# EAGLE schematic Main Board (EAGLE 5.10)
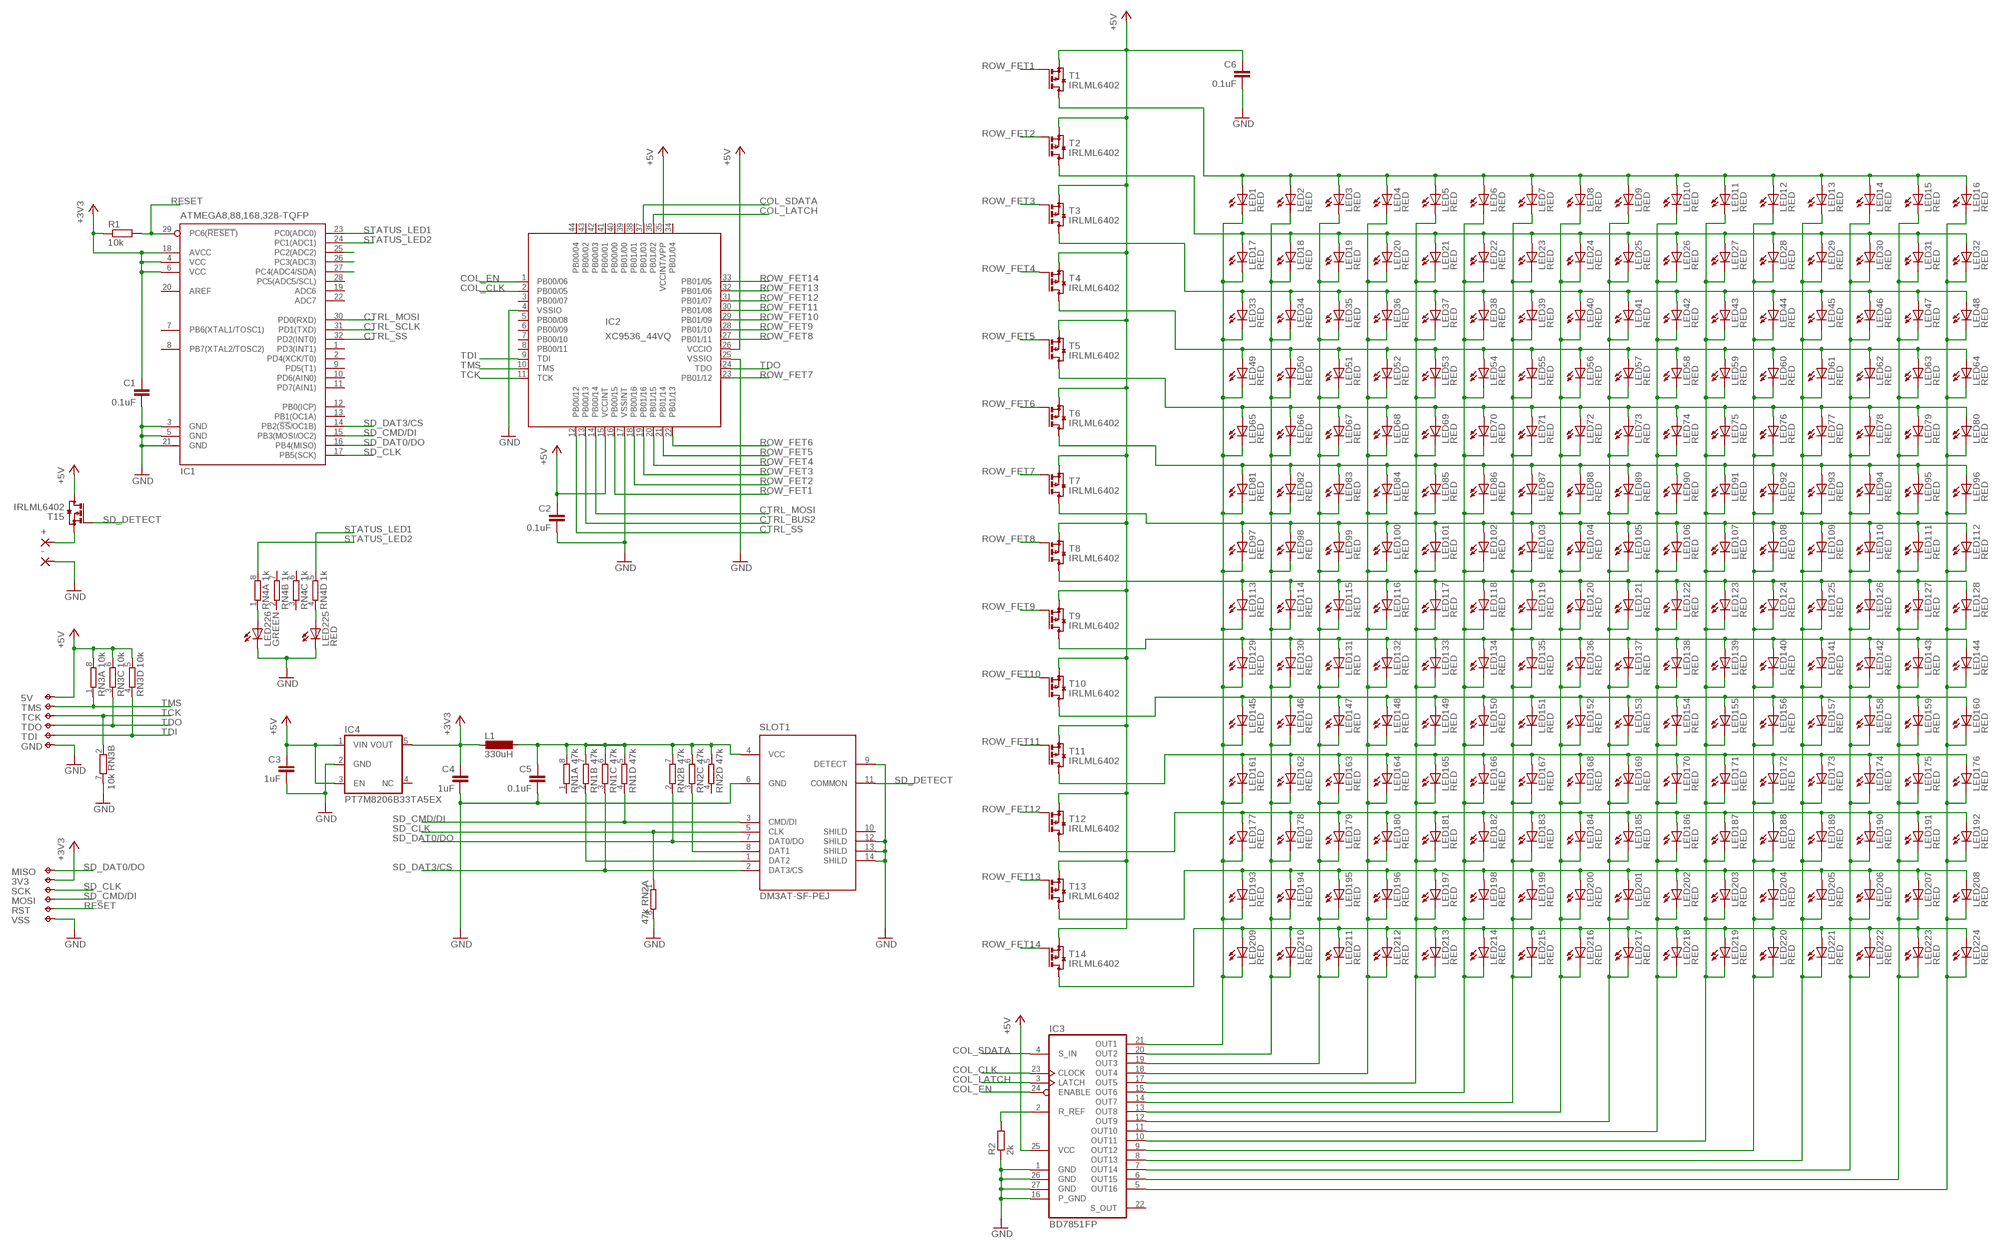
[diagram p0: schematic, sheet 1]

## Parts
3V3  TPTP10SQ  [TP10SQ]
5V  TPTP10SQ  [TP10SQ]
+  SMD2  [SMD1,27-2,54]
-  SMD2  [SMD1,27-2,54]
C1  0.1uF  C-EUC0603  [C0603]
C2  0.1uF  C-EUC0603  [C0603]
C3  1uF  C-EUC0603  [C0603]
C4  1uF  C-EUC0603  [C0603]
C5  0.1uF  C-EUC0603  [C0603]
C6  0.1uF  C-EUC0603  [C0603]
GND  TPTP10SQ  [TP10SQ]
IC1  ATMEGA8,88,168,328-TQFP  [TQFP32-08]
IC2  XC9536_44VQ  [SQFP-S-10X10-44]
IC3  BD7851FP  [HSOP25]
IC4  PT7M8206B33TA5EX  [SOT23-5L]
L1  330uH  L-EUL2012C  [L2012C]
LED1  RED  LEDCHIP-LED0603  [CHIP-LED0603]
LED2  RED  LEDCHIP-LED0603  [CHIP-LED0603]
LED3  RED  LEDCHIP-LED0603  [CHIP-LED0603]
LED4  RED  LEDCHIP-LED0603  [CHIP-LED0603]
LED5  RED  LEDCHIP-LED0603  [CHIP-LED0603]
LED6  RED  LEDCHIP-LED0603  [CHIP-LED0603]
LED7  RED  LEDCHIP-LED0603  [CHIP-LED0603]
LED8  RED  LEDCHIP-LED0603  [CHIP-LED0603]
LED9  RED  LEDCHIP-LED0603  [CHIP-LED0603]
LED10  RED  LEDCHIP-LED0603  [CHIP-LED0603]
LED11  RED  LEDCHIP-LED0603  [CHIP-LED0603]
LED12  RED  LEDCHIP-LED0603  [CHIP-LED0603]
LED13  RED  LEDCHIP-LED0603  [CHIP-LED0603]
LED14  RED  LEDCHIP-LED0603  [CHIP-LED0603]
LED15  RED  LEDCHIP-LED0603  [CHIP-LED0603]
LED16  RED  LEDCHIP-LED0603  [CHIP-LED0603]
LED17  RED  LEDCHIP-LED0603  [CHIP-LED0603]
LED18  RED  LEDCHIP-LED0603  [CHIP-LED0603]
LED19  RED  LEDCHIP-LED0603  [CHIP-LED0603]
LED20  RED  LEDCHIP-LED0603  [CHIP-LED0603]
LED21  RED  LEDCHIP-LED0603  [CHIP-LED0603]
LED22  RED  LEDCHIP-LED0603  [CHIP-LED0603]
LED23  RED  LEDCHIP-LED0603  [CHIP-LED0603]
LED24  RED  LEDCHIP-LED0603  [CHIP-LED0603]
LED25  RED  LEDCHIP-LED0603  [CHIP-LED0603]
LED26  RED  LEDCHIP-LED0603  [CHIP-LED0603]
LED27  RED  LEDCHIP-LED0603  [CHIP-LED0603]
LED28  RED  LEDCHIP-LED0603  [CHIP-LED0603]
LED29  RED  LEDCHIP-LED0603  [CHIP-LED0603]
LED30  RED  LEDCHIP-LED0603  [CHIP-LED0603]
LED31  RED  LEDCHIP-LED0603  [CHIP-LED0603]
LED32  RED  LEDCHIP-LED0603  [CHIP-LED0603]
LED33  RED  LEDCHIP-LED0603  [CHIP-LED0603]
LED34  RED  LEDCHIP-LED0603  [CHIP-LED0603]
LED35  RED  LEDCHIP-LED0603  [CHIP-LED0603]
LED36  RED  LEDCHIP-LED0603  [CHIP-LED0603]
LED37  RED  LEDCHIP-LED0603  [CHIP-LED0603]
LED38  RED  LEDCHIP-LED0603  [CHIP-LED0603]
LED39  RED  LEDCHIP-LED0603  [CHIP-LED0603]
LED40  RED  LEDCHIP-LED0603  [CHIP-LED0603]
LED41  RED  LEDCHIP-LED0603  [CHIP-LED0603]
LED42  RED  LEDCHIP-LED0603  [CHIP-LED0603]
LED43  RED  LEDCHIP-LED0603  [CHIP-LED0603]
LED44  RED  LEDCHIP-LED0603  [CHIP-LED0603]
LED45  RED  LEDCHIP-LED0603  [CHIP-LED0603]
LED46  RED  LEDCHIP-LED0603  [CHIP-LED0603]
LED47  RED  LEDCHIP-LED0603  [CHIP-LED0603]
LED48  RED  LEDCHIP-LED0603  [CHIP-LED0603]
LED49  RED  LEDCHIP-LED0603  [CHIP-LED0603]
LED50  RED  LEDCHIP-LED0603  [CHIP-LED0603]
LED51  RED  LEDCHIP-LED0603  [CHIP-LED0603]
LED52  RED  LEDCHIP-LED0603  [CHIP-LED0603]
LED53  RED  LEDCHIP-LED0603  [CHIP-LED0603]
LED54  RED  LEDCHIP-LED0603  [CHIP-LED0603]
LED55  RED  LEDCHIP-LED0603  [CHIP-LED0603]
LED56  RED  LEDCHIP-LED0603  [CHIP-LED0603]
LED57  RED  LEDCHIP-LED0603  [CHIP-LED0603]
LED58  RED  LEDCHIP-LED0603  [CHIP-LED0603]
LED59  RED  LEDCHIP-LED0603  [CHIP-LED0603]
LED60  RED  LEDCHIP-LED0603  [CHIP-LED0603]
LED61  RED  LEDCHIP-LED0603  [CHIP-LED0603]
LED62  RED  LEDCHIP-LED0603  [CHIP-LED0603]
LED63  RED  LEDCHIP-LED0603  [CHIP-LED0603]
LED64  RED  LEDCHIP-LED0603  [CHIP-LED0603]
LED65  RED  LEDCHIP-LED0603  [CHIP-LED0603]
LED66  RED  LEDCHIP-LED0603  [CHIP-LED0603]
LED67  RED  LEDCHIP-LED0603  [CHIP-LED0603]
LED68  RED  LEDCHIP-LED0603  [CHIP-LED0603]
LED69  RED  LEDCHIP-LED0603  [CHIP-LED0603]
LED70  RED  LEDCHIP-LED0603  [CHIP-LED0603]
LED71  RED  LEDCHIP-LED0603  [CHIP-LED0603]
LED72  RED  LEDCHIP-LED0603  [CHIP-LED0603]
LED73  RED  LEDCHIP-LED0603  [CHIP-LED0603]
LED74  RED  LEDCHIP-LED0603  [CHIP-LED0603]
LED75  RED  LEDCHIP-LED0603  [CHIP-LED0603]
LED76  RED  LEDCHIP-LED0603  [CHIP-LED0603]
LED77  RED  LEDCHIP-LED0603  [CHIP-LED0603]
LED78  RED  LEDCHIP-LED0603  [CHIP-LED0603]
LED79  RED  LEDCHIP-LED0603  [CHIP-LED0603]
LED80  RED  LEDCHIP-LED0603  [CHIP-LED0603]
LED81  RED  LEDCHIP-LED0603  [CHIP-LED0603]
LED82  RED  LEDCHIP-LED0603  [CHIP-LED0603]
LED83  RED  LEDCHIP-LED0603  [CHIP-LED0603]
LED84  RED  LEDCHIP-LED0603  [CHIP-LED0603]
LED85  RED  LEDCHIP-LED0603  [CHIP-LED0603]
LED86  RED  LEDCHIP-LED0603  [CHIP-LED0603]
LED87  RED  LEDCHIP-LED0603  [CHIP-LED0603]
LED88  RED  LEDCHIP-LED0603  [CHIP-LED0603]
LED89  RED  LEDCHIP-LED0603  [CHIP-LED0603]
LED90  RED  LEDCHIP-LED0603  [CHIP-LED0603]
LED91  RED  LEDCHIP-LED0603  [CHIP-LED0603]
LED92  RED  LEDCHIP-LED0603  [CHIP-LED0603]
LED93  RED  LEDCHIP-LED0603  [CHIP-LED0603]
LED94  RED  LEDCHIP-LED0603  [CHIP-LED0603]
LED95  RED  LEDCHIP-LED0603  [CHIP-LED0603]
LED96  RED  LEDCHIP-LED0603  [CHIP-LED0603]
LED97  RED  LEDCHIP-LED0603  [CHIP-LED0603]
LED98  RED  LEDCHIP-LED0603  [CHIP-LED0603]
LED99  RED  LEDCHIP-LED0603  [CHIP-LED0603]
LED100  RED  LEDCHIP-LED0603  [CHIP-LED0603]
LED101  RED  LEDCHIP-LED0603  [CHIP-LED0603]
LED102  RED  LEDCHIP-LED0603  [CHIP-LED0603]
LED103  RED  LEDCHIP-LED0603  [CHIP-LED0603]
LED104  RED  LEDCHIP-LED0603  [CHIP-LED0603]
LED105  RED  LEDCHIP-LED0603  [CHIP-LED0603]
LED106  RED  LEDCHIP-LED0603  [CHIP-LED0603]
LED107  RED  LEDCHIP-LED0603  [CHIP-LED0603]
LED108  RED  LEDCHIP-LED0603  [CHIP-LED0603]
LED109  RED  LEDCHIP-LED0603  [CHIP-LED0603]
LED110  RED  LEDCHIP-LED0603  [CHIP-LED0603]
LED111  RED  LEDCHIP-LED0603  [CHIP-LED0603]
LED112  RED  LEDCHIP-LED0603  [CHIP-LED0603]
LED113  RED  LEDCHIP-LED0603  [CHIP-LED0603]
LED114  RED  LEDCHIP-LED0603  [CHIP-LED0603]
LED115  RED  LEDCHIP-LED0603  [CHIP-LED0603]
LED116  RED  LEDCHIP-LED0603  [CHIP-LED0603]
LED117  RED  LEDCHIP-LED0603  [CHIP-LED0603]
LED118  RED  LEDCHIP-LED0603  [CHIP-LED0603]
LED119  RED  LEDCHIP-LED0603  [CHIP-LED0603]
LED120  RED  LEDCHIP-LED0603  [CHIP-LED0603]
LED121  RED  LEDCHIP-LED0603  [CHIP-LED0603]
LED122  RED  LEDCHIP-LED0603  [CHIP-LED0603]
LED123  RED  LEDCHIP-LED0603  [CHIP-LED0603]
LED124  RED  LEDCHIP-LED0603  [CHIP-LED0603]
LED125  RED  LEDCHIP-LED0603  [CHIP-LED0603]
LED126  RED  LEDCHIP-LED0603  [CHIP-LED0603]
LED127  RED  LEDCHIP-LED0603  [CHIP-LED0603]
LED128  RED  LEDCHIP-LED0603  [CHIP-LED0603]
LED129  RED  LEDCHIP-LED0603  [CHIP-LED0603]
LED130  RED  LEDCHIP-LED0603  [CHIP-LED0603]
LED131  RED  LEDCHIP-LED0603  [CHIP-LED0603]
LED132  RED  LEDCHIP-LED0603  [CHIP-LED0603]
LED133  RED  LEDCHIP-LED0603  [CHIP-LED0603]
LED134  RED  LEDCHIP-LED0603  [CHIP-LED0603]
LED135  RED  LEDCHIP-LED0603  [CHIP-LED0603]
LED136  RED  LEDCHIP-LED0603  [CHIP-LED0603]
LED137  RED  LEDCHIP-LED0603  [CHIP-LED0603]
LED138  RED  LEDCHIP-LED0603  [CHIP-LED0603]
LED139  RED  LEDCHIP-LED0603  [CHIP-LED0603]
LED140  RED  LEDCHIP-LED0603  [CHIP-LED0603]
LED141  RED  LEDCHIP-LED0603  [CHIP-LED0603]
LED142  RED  LEDCHIP-LED0603  [CHIP-LED0603]
LED143  RED  LEDCHIP-LED0603  [CHIP-LED0603]
LED144  RED  LEDCHIP-LED0603  [CHIP-LED0603]
LED145  RED  LEDCHIP-LED0603  [CHIP-LED0603]
LED146  RED  LEDCHIP-LED0603  [CHIP-LED0603]
LED147  RED  LEDCHIP-LED0603  [CHIP-LED0603]
LED148  RED  LEDCHIP-LED0603  [CHIP-LED0603]
LED149  RED  LEDCHIP-LED0603  [CHIP-LED0603]
LED150  RED  LEDCHIP-LED0603  [CHIP-LED0603]
LED151  RED  LEDCHIP-LED0603  [CHIP-LED0603]
LED152  RED  LEDCHIP-LED0603  [CHIP-LED0603]
LED153  RED  LEDCHIP-LED0603  [CHIP-LED0603]
LED154  RED  LEDCHIP-LED0603  [CHIP-LED0603]
LED155  RED  LEDCHIP-LED0603  [CHIP-LED0603]
LED156  RED  LEDCHIP-LED0603  [CHIP-LED0603]
LED157  RED  LEDCHIP-LED0603  [CHIP-LED0603]
LED158  RED  LEDCHIP-LED0603  [CHIP-LED0603]
LED159  RED  LEDCHIP-LED0603  [CHIP-LED0603]
LED160  RED  LEDCHIP-LED0603  [CHIP-LED0603]
LED161  RED  LEDCHIP-LED0603  [CHIP-LED0603]
LED162  RED  LEDCHIP-LED0603  [CHIP-LED0603]
LED163  RED  LEDCHIP-LED0603  [CHIP-LED0603]
LED164  RED  LEDCHIP-LED0603  [CHIP-LED0603]
LED165  RED  LEDCHIP-LED0603  [CHIP-LED0603]
LED166  RED  LEDCHIP-LED0603  [CHIP-LED0603]
LED167  RED  LEDCHIP-LED0603  [CHIP-LED0603]
LED168  RED  LEDCHIP-LED0603  [CHIP-LED0603]
LED169  RED  LEDCHIP-LED0603  [CHIP-LED0603]
LED170  RED  LEDCHIP-LED0603  [CHIP-LED0603]
LED171  RED  LEDCHIP-LED0603  [CHIP-LED0603]
LED172  RED  LEDCHIP-LED0603  [CHIP-LED0603]
LED173  RED  LEDCHIP-LED0603  [CHIP-LED0603]
LED174  RED  LEDCHIP-LED0603  [CHIP-LED0603]
LED175  RED  LEDCHIP-LED0603  [CHIP-LED0603]
LED176  RED  LEDCHIP-LED0603  [CHIP-LED0603]
LED177  RED  LEDCHIP-LED0603  [CHIP-LED0603]
LED178  RED  LEDCHIP-LED0603  [CHIP-LED0603]
LED179  RED  LEDCHIP-LED0603  [CHIP-LED0603]
LED180  RED  LEDCHIP-LED0603  [CHIP-LED0603]
LED181  RED  LEDCHIP-LED0603  [CHIP-LED0603]
LED182  RED  LEDCHIP-LED0603  [CHIP-LED0603]
LED183  RED  LEDCHIP-LED0603  [CHIP-LED0603]
LED184  RED  LEDCHIP-LED0603  [CHIP-LED0603]
LED185  RED  LEDCHIP-LED0603  [CHIP-LED0603]
LED186  RED  LEDCHIP-LED0603  [CHIP-LED0603]
LED187  RED  LEDCHIP-LED0603  [CHIP-LED0603]
LED188  RED  LEDCHIP-LED0603  [CHIP-LED0603]
LED189  RED  LEDCHIP-LED0603  [CHIP-LED0603]
LED190  RED  LEDCHIP-LED0603  [CHIP-LED0603]
LED191  RED  LEDCHIP-LED0603  [CHIP-LED0603]
LED192  RED  LEDCHIP-LED0603  [CHIP-LED0603]
LED193  RED  LEDCHIP-LED0603  [CHIP-LED0603]
LED194  RED  LEDCHIP-LED0603  [CHIP-LED0603]
LED195  RED  LEDCHIP-LED0603  [CHIP-LED0603]
LED196  RED  LEDCHIP-LED0603  [CHIP-LED0603]
LED197  RED  LEDCHIP-LED0603  [CHIP-LED0603]
LED198  RED  LEDCHIP-LED0603  [CHIP-LED0603]
LED199  RED  LEDCHIP-LED0603  [CHIP-LED0603]
LED200  RED  LEDCHIP-LED0603  [CHIP-LED0603]
LED201  RED  LEDCHIP-LED0603  [CHIP-LED0603]
LED202  RED  LEDCHIP-LED0603  [CHIP-LED0603]
LED203  RED  LEDCHIP-LED0603  [CHIP-LED0603]
LED204  RED  LEDCHIP-LED0603  [CHIP-LED0603]
LED205  RED  LEDCHIP-LED0603  [CHIP-LED0603]
LED206  RED  LEDCHIP-LED0603  [CHIP-LED0603]
LED207  RED  LEDCHIP-LED0603  [CHIP-LED0603]
LED208  RED  LEDCHIP-LED0603  [CHIP-LED0603]
LED209  RED  LEDCHIP-LED0603  [CHIP-LED0603]
LED210  RED  LEDCHIP-LED0603  [CHIP-LED0603]
LED211  RED  LEDCHIP-LED0603  [CHIP-LED0603]
LED212  RED  LEDCHIP-LED0603  [CHIP-LED0603]
LED213  RED  LEDCHIP-LED0603  [CHIP-LED0603]
LED214  RED  LEDCHIP-LED0603  [CHIP-LED0603]
LED215  RED  LEDCHIP-LED0603  [CHIP-LED0603]
LED216  RED  LEDCHIP-LED0603  [CHIP-LED0603]
LED217  RED  LEDCHIP-LED0603  [CHIP-LED0603]
LED218  RED  LEDCHIP-LED0603  [CHIP-LED0603]
LED219  RED  LEDCHIP-LED0603  [CHIP-LED0603]
LED220  RED  LEDCHIP-LED0603  [CHIP-LED0603]
LED221  RED  LEDCHIP-LED0603  [CHIP-LED0603]
LED222  RED  LEDCHIP-LED0603  [CHIP-LED0603]
LED223  RED  LEDCHIP-LED0603  [CHIP-LED0603]
LED224  RED  LEDCHIP-LED0603  [CHIP-LED0603]
LED225  RED  LEDCHIP-LED0603  [CHIP-LED0603]
LED226  GREEN  LEDCHIP-LED0603  [CHIP-LED0603]
MISO  TPTP10SQ  [TP10SQ]
MOSI  TPTP10SQ  [TP10SQ]
R1  10k  R-EU_R0603  [R0603]
R2  2k  R-EU_R0603  [R0603]
RN1  47k  4R-NEXBN8V  [EXBN8V]
RN2  47k  4R-NEXBN8V  [EXBN8V]
RN3  10k  4R-NEXBN8V  [EXBN8V]
RN4  1k  4R-NEXBN8V  [EXBN8V]
RST  TPTP10SQ  [TP10SQ]
SCK  TPTP10SQ  [TP10SQ]
SLOT1  DM3AT-SF-PEJ  [DM3AT-SF-PEJ]
T1  IRLML6402  BSS84  [SOT23]
T2  IRLML6402  BSS84  [SOT23]
T3  IRLML6402  BSS84  [SOT23]
T4  IRLML6402  BSS84  [SOT23]
T5  IRLML6402  BSS84  [SOT23]
T6  IRLML6402  BSS84  [SOT23]
T7  IRLML6402  BSS84  [SOT23]
T8  IRLML6402  BSS84  [SOT23]
T9  IRLML6402  BSS84  [SOT23]
T10  IRLML6402  BSS84  [SOT23]
T11  IRLML6402  BSS84  [SOT23]
T12  IRLML6402  BSS84  [SOT23]
T13  IRLML6402  BSS84  [SOT23]
T14  IRLML6402  BSS84  [SOT23]
T15  IRLML6402  BSS84  [SOT23]
TCK  TPTP10SQ  [TP10SQ]
TDI  TPTP10SQ  [TP10SQ]
TDO  TPTP10SQ  [TP10SQ]
TMS  TPTP10SQ  [TP10SQ]
VSS  TPTP10SQ  [TP10SQ]

## Nets
+3V3: 3V3.TP C1.1 C4.1 IC1.4(VCC) IC1.6(VCC) IC1.18(AVCC) IC4.5(VOUT) L1.2 R1.1
+5V: 5V.TP C2.1 C3.1 C6.1 IC2.15(VCCINT) IC2.26(VCCIO) IC2.35(VCCINT/VPP) IC3.25(VCC) IC4.1(VIN) IC4.3(EN) RN3.5 RN3.6 RN3.8 T1.2(S) T2.2(S) T3.2(S) T4.2(S) T5.2(S) T6.2(S) T7.2(S) T8.2(S) T9.2(S) T10.2(S) T11.2(S) T12.2(S) T13.2(S) T14.2(S) T15.3(D)
COL_CLK: IC2.2(PB00/05) IC3.23(CLOCK)
COL_EN: IC2.1(PB00/06) IC3.24(ENABLE)
COL_LATCH: IC2.36(PB01/02) IC3.3(LATCH)
COL_SDATA: IC2.37(PB01/03) IC3.4(S_IN)
CTRL_BUS2: IC2.13(PB00/13)
CTRL_MOSI: IC1.30(PD0(RXD)) IC2.14(PB00/14)
CTRL_SCLK: IC1.31(PD1(TXD))
CTRL_SS: IC1.32(PD2(INT0)) IC2.12(PB00/12)
GND: -.1(P) C1.2 C2.2 C3.2 C4.2 C5.2 C6.2 GND.TP IC1.3(GND) IC1.5(GND) IC1.21(GND) IC2.4(VSSIO) IC2.17(VSSINT) IC2.25(VSSIO) IC3.1(GND) IC3.16(P_GND) IC3.26(GND) IC3.27(GND) IC4.2(GND) LED225.C LED226.C R2.1 RN2.8 RN3.7 SLOT1.6(GND) SLOT1.9(DETECT) SLOT1.12(SHILD) SLOT1.13(SHILD) SLOT1.14(SHILD) VSS.TP
N$1: LED113.A LED114.A LED115.A LED116.A LED117.A LED118.A LED119.A LED120.A LED121.A LED122.A LED123.A LED124.A LED125.A LED126.A LED127.A LED128.A T8.3(D)
N$2: IC3.14(OUT7) LED7.C LED23.C LED39.C LED55.C LED71.C LED87.C LED103.C LED119.C LED135.C LED151.C LED167.C LED183.C LED199.C LED215.C
N$3: IC3.13(OUT8) LED8.C LED24.C LED40.C LED56.C LED72.C LED88.C LED104.C LED120.C LED136.C LED152.C LED168.C LED184.C LED200.C LED216.C
N$4: IC3.12(OUT9) LED9.C LED25.C LED41.C LED57.C LED73.C LED89.C LED105.C LED121.C LED137.C LED153.C LED169.C LED185.C LED201.C LED217.C
N$5: LED17.A LED18.A LED19.A LED20.A LED21.A LED22.A LED23.A LED24.A LED25.A LED26.A LED27.A LED28.A LED29.A LED30.A LED31.A LED32.A T2.3(D)
N$6: LED33.A LED34.A LED35.A LED36.A LED37.A LED38.A LED39.A LED40.A LED41.A LED42.A LED43.A LED44.A LED45.A LED46.A LED47.A LED48.A T3.3(D)
N$7: LED49.A LED50.A LED51.A LED52.A LED53.A LED54.A LED55.A LED56.A LED57.A LED58.A LED59.A LED60.A LED61.A LED62.A LED63.A LED64.A T4.3(D)
N$8: LED65.A LED66.A LED67.A LED68.A LED69.A LED70.A LED71.A LED72.A LED73.A LED74.A LED75.A LED76.A LED77.A LED78.A LED79.A LED80.A T5.3(D)
N$9: LED81.A LED82.A LED83.A LED84.A LED85.A LED86.A LED87.A LED88.A LED89.A LED90.A LED91.A LED92.A LED93.A LED94.A LED95.A LED96.A T6.3(D)
N$10: LED177.A LED178.A LED179.A LED180.A LED181.A LED182.A LED183.A LED184.A LED185.A LED186.A LED187.A LED188.A LED189.A LED190.A LED191.A LED192.A T12.3(D)
N$11: IC3.11(OUT10) LED10.C LED26.C LED42.C LED58.C LED74.C LED90.C LED106.C LED122.C LED138.C LED154.C LED170.C LED186.C LED202.C LED218.C
N$12: LED129.A LED130.A LED131.A LED132.A LED133.A LED134.A LED135.A LED136.A LED137.A LED138.A LED139.A LED140.A LED141.A LED142.A LED143.A LED144.A T9.3(D)
N$13: LED145.A LED146.A LED147.A LED148.A LED149.A LED150.A LED151.A LED152.A LED153.A LED154.A LED155.A LED156.A LED157.A LED158.A LED159.A LED160.A T10.3(D)
N$14: LED161.A LED162.A LED163.A LED164.A LED165.A LED166.A LED167.A LED168.A LED169.A LED170.A LED171.A LED172.A LED173.A LED174.A LED175.A LED176.A T11.3(D)
N$15: IC3.10(OUT11) LED11.C LED27.C LED43.C LED59.C LED75.C LED91.C LED107.C LED123.C LED139.C LED155.C LED171.C LED187.C LED203.C LED219.C
N$16: LED193.A LED194.A LED195.A LED196.A LED197.A LED198.A LED199.A LED200.A LED201.A LED202.A LED203.A LED204.A LED205.A LED206.A LED207.A LED208.A T13.3(D)
N$17: LED209.A LED210.A LED211.A LED212.A LED213.A LED214.A LED215.A LED216.A LED217.A LED218.A LED219.A LED220.A LED221.A LED222.A LED223.A LED224.A T14.3(D)
N$18: LED226.A RN4.1
N$19: IC3.21(OUT1) LED1.C LED17.C LED33.C LED49.C LED65.C LED81.C LED97.C LED113.C LED129.C LED145.C LED161.C LED177.C LED193.C LED209.C
N$20: IC3.20(OUT2) LED2.C LED18.C LED34.C LED50.C LED66.C LED82.C LED98.C LED114.C LED130.C LED146.C LED162.C LED178.C LED194.C LED210.C
N$21: IC3.19(OUT3) LED3.C LED19.C LED35.C LED51.C LED67.C LED83.C LED99.C LED115.C LED131.C LED147.C LED163.C LED179.C LED195.C LED211.C
N$22: IC3.18(OUT4) LED4.C LED20.C LED36.C LED52.C LED68.C LED84.C LED100.C LED116.C LED132.C LED148.C LED164.C LED180.C LED196.C LED212.C
N$23: IC3.17(OUT5) LED5.C LED21.C LED37.C LED53.C LED69.C LED85.C LED101.C LED117.C LED133.C LED149.C LED165.C LED181.C LED197.C LED213.C
N$24: IC3.15(OUT6) LED6.C LED22.C LED38.C LED54.C LED70.C LED86.C LED102.C LED118.C LED134.C LED150.C LED166.C LED182.C LED198.C LED214.C
N$25: LED225.A RN4.4
N$26: +.1(P) T15.2(S)
N$27: IC1.26(PC3(ADC3))
N$28: IC1.27(PC4(ADC4/SDA))
N$29: IC1.25(PC2(ADC2))
N$34: IC3.2(R_REF) R2.2
N$35: IC3.9(OUT12) LED12.C LED28.C LED44.C LED60.C LED76.C LED92.C LED108.C LED124.C LED140.C LED156.C LED172.C LED188.C LED204.C LED220.C
N$36: LED97.A LED98.A LED99.A LED100.A LED101.A LED102.A LED103.A LED104.A LED105.A LED106.A LED107.A LED108.A LED109.A LED110.A LED111.A LED112.A T7.3(D)
N$37: IC3.8(OUT13) LED13.C LED29.C LED45.C LED61.C LED77.C LED93.C LED109.C LED125.C LED141.C LED157.C LED173.C LED189.C LED205.C LED221.C
N$39: LED1.A LED2.A LED3.A LED4.A LED5.A LED6.A LED7.A LED8.A LED9.A LED10.A LED11.A LED12.A LED13.A LED14.A LED15.A LED16.A T1.3(D)
N$41: IC3.7(OUT14) LED14.C LED30.C LED46.C LED62.C LED78.C LED94.C LED110.C LED126.C LED142.C LED158.C LED174.C LED190.C LED206.C LED222.C
N$42: IC3.6(OUT15) LED15.C LED31.C LED47.C LED63.C LED79.C LED95.C LED111.C LED127.C LED143.C LED159.C LED175.C LED191.C LED207.C LED223.C
N$43: IC3.5(OUT16) LED16.C LED32.C LED48.C LED64.C LED80.C LED96.C LED112.C LED128.C LED144.C LED160.C LED176.C LED192.C LED208.C LED224.C
RESET: IC1.29(PC6(!RESET!)) R1.2 RST.TP
ROW_FET1: IC2.16(PB00/15) T1.1(G)
ROW_FET2: IC2.18(PB00/16) T2.1(G)
ROW_FET3: IC2.19(PB01/16) T3.1(G)
ROW_FET4: IC2.20(PB01/15) T4.1(G)
ROW_FET5: IC2.21(PB01/14) T5.1(G)
ROW_FET6: IC2.22(PB01/13) T6.1(G)
ROW_FET7: IC2.23(PB01/12) T7.1(G)
ROW_FET8: IC2.27(PB01/11) T8.1(G)
ROW_FET9: IC2.28(PB01/10) T9.1(G)
ROW_FET10: IC2.29(PB01/09) T10.1(G)
ROW_FET11: IC2.30(PB01/08) T11.1(G)
ROW_FET12: IC2.31(PB01/07) T12.1(G)
ROW_FET13: IC2.32(PB01/06) T13.1(G)
ROW_FET14: IC2.33(PB01/05) T14.1(G)
SD_CLK: IC1.17(PB5(SCK)) RN2.1 SCK.TP SLOT1.5(CLK)
SD_CMD/DI: IC1.15(PB3(MOSI/OC2)) MOSI.TP RN1.4 SLOT1.3(CMD/DI)
SD_DAT0/DO: IC1.16(PB4(MISO)) MISO.TP RN2.2 SLOT1.7(DAT0/DO)
SD_DAT1: RN2.3 SLOT1.8(DAT1)
SD_DAT2: RN1.2 SLOT1.1(DAT2)
SD_DAT3/CS: IC1.14(PB2(!SS!/OC1B)) RN1.3 SLOT1.2(DAT3/CS)
SD_DETECT: SLOT1.11(COMMON) T15.1(G)
STATUS_LED1: IC1.23(PC0(ADC0)) RN4.5
STATUS_LED2: IC1.24(PC1(ADC1)) RN4.8
TCK: IC2.11(TCK) RN3.2 TCK.TP
TDI: IC2.9(TDI) RN3.4 TDI.TP
TDO: IC2.24(TDO) RN3.3 TDO.TP
TMS: IC2.10(TMS) RN3.1 TMS.TP
VCC1: C5.1 L1.1 RN1.5 RN1.6 RN1.7 RN1.8 RN2.5 RN2.6 RN2.7 SLOT1.4(VCC)
Unconnected: IC1.1(PD3(INT1)) IC1.2(PD4(XCK/T0)) IC1.7(PB6(XTAL1/TOSC1)) IC1.8(PB7(XTAL2/TOSC2)) IC1.9(PD5(T1)) IC1.10(PD6(AIN0)) IC1.11(PD7(AIN1)) IC1.12(PB0(ICP)) IC1.13(PB1(OC1A)) IC1.19(ADC6) IC1.20(AREF) IC1.22(ADC7) IC1.28(PC5(ADC5/SCL)) IC2.3(PB00/07) IC2.5(PB00/08) IC2.6(PB00/09) IC2.7(PB00/10) IC2.8(PB00/11) IC2.34(PB01/04) IC2.38(PB01/01) IC2.39(PB01/00) IC2.40(PB00/00) IC2.41(PB00/01) IC2.42(PB00/03) IC2.43(PB00/02) IC2.44(PB00/04) IC3.22(S_OUT) IC4.4(NC) RN1.1 RN2.4 RN4.2 RN4.3 RN4.6 RN4.7 SLOT1.10(SHILD)

## Library data of the parts
3V3 5V GND MISO MOSI RST SCK TCK TDI TDO TMS VSS = testpad:TP: Test pad
+ - = wirepad:SMD2: SMD PAD
C1-C6 = resistor:C-EU: CAPACITOR, European symbol
IC1 = atmel:ATMEGA8,88,168,328-TQFP: MICROCONTROLLER 4/8/16/32K Bytes Flash 256/512/512/1K Bytes EEPROM 512/1K/1K/2K1K Byte Internal SRAM
IC2 = xilinx-xc9:XC9536_44VQ: xc9536_pc44 XC9500 In-System Programmable CPLD Family Auto generated by make-symbol-device-package-bsdl.ulp Rev. 34 Source: xc9536_vq44.bsd
IC3 = rohm:BD7851FP
IC4 = pericom technology:PT7M8206B33TA5EX: 300mA Low Noise LDO Voltage Regulator with Enable Source: http://www.pti-ic.com/new/manage/doc_datasheet/PT0359%20PT7M8206-1.pdf
L1 = resistor:L-EU: INDUCTOR, European symbol
LED1-LED226 = led:LED: LED OSRAM: - CHIPLED LG R971, LG N971, LY N971, LG Q971, LY Q971, LO R971, LY R971 LH N974, LH R974 LS Q976, LO Q976, LY Q976 LO Q996 - Hyper CHIPLED LW Q18S LB Q993, LB Q99A, LB R99A - SideLED LS A670, LO A670, LY A670, LG A670, LP A670 LB A673, LV A673, LT A673, LW A673 LH A674 LY A675 LS A676, LA A676, LO A676, LY A676, LW A676 LS A679, LY A679, LG A679 - Hyper Micro SIDELED® LS Y876, LA Y876, LO Y876, LY Y876 LT Y87S - SmartLED LW L88C, LW L88S LB L89C, LB L89S, LG L890 LS L89K, LO L89K, LY L89K LS L896, LA L896, LO L896, LY L896 - TOPLED LS T670, LO T670, LY T670, LG T670, LP T670 LSG T670, LSP T670, LSY T670, LOP T670, LYG T670 LG T671, LOG T671, LSG T671 LB T673, LV T673, LT T673, LW T673 LH T674 LS T676, LA T676, LO T676, LY T676, LB T676, LH T676, LSB T676, LW T676 LB T67C, LV T67C, LT T67C, LS T67K, LO T67K, LY T67K, LW E67C LS E67B, LA E67B, LO E67B, LY E67B, LB E67C, LV E67C, LT E67C LW T67C LS T679, LY T679, LG T679 LS T770, LO T770, LY T770, LG T770, LP T770 LB T773, LV T773, LT T773, LW T773 LH T774 LS E675, LA E675, LY E675, LS T675 LS T776, LA T776, LO T776, LY T776, LB T776 LHGB T686 LT T68C, LB T68C - Hyper Mini TOPLED® LB M676 - Mini TOPLED Santana® LG M470 LS M47K, LO M47K, LY M47K Source: http://www.osram.convergy.de LUXEON: - LUMILED® LXK2-PW12-R00, LXK2-PW12-S00, LXK2-PW14-U00, LXK2-PW14-V00 LXK2-PM12-R00, LXK2-PM12-S00, LXK2-PM14-U00 LXK2-PE12-Q00, LXK2-PE12-R00, LXK2-PE12-S00, LXK2-PE14-T00, LXK2-PE14-U00 LXK2-PB12-K00, LXK2-PB12-L00, LXK2-PB12-M00, LXK2-PB14-N00, LXK2-PB14-P00, LXK2-PB14-Q00 LXK2-PR12-L00, LXK2-PR12-M00, LXK2-PR14-Q00, LXK2-PR14-R00 LXK2-PD12-Q00, LXK2-PD12-R00, LXK2-PD12-S00 LXK2-PH12-R00, LXK2-PH12-S00 LXK2-PL12-P00, LXK2-PL12-Q00, LXK2-PL12-R00 Source: www.luxeon.com KINGBRIGHT: KA-3528ASYC Source: www.kingbright.com
R1 R2 = resistor:R-EU_: RESISTOR, European symbol
RN1-RN4 = resistor-dil:4R-N: Array Chip Resistor Source: RS Component / Phycomp
SLOT1 = hirose:DM3AT-SF-PEJ: micro SD Card (Standard Type) Source: http://www.hirose.co.jp/catalogj_hp/j60900232.pdf
T1-T15 = transistor-small-signal:BSS84: P-CHANNEL MOS FET